# Altium schematic sheet Sheet_1_2026-01-07.schdoc
size 307 x 212 mm
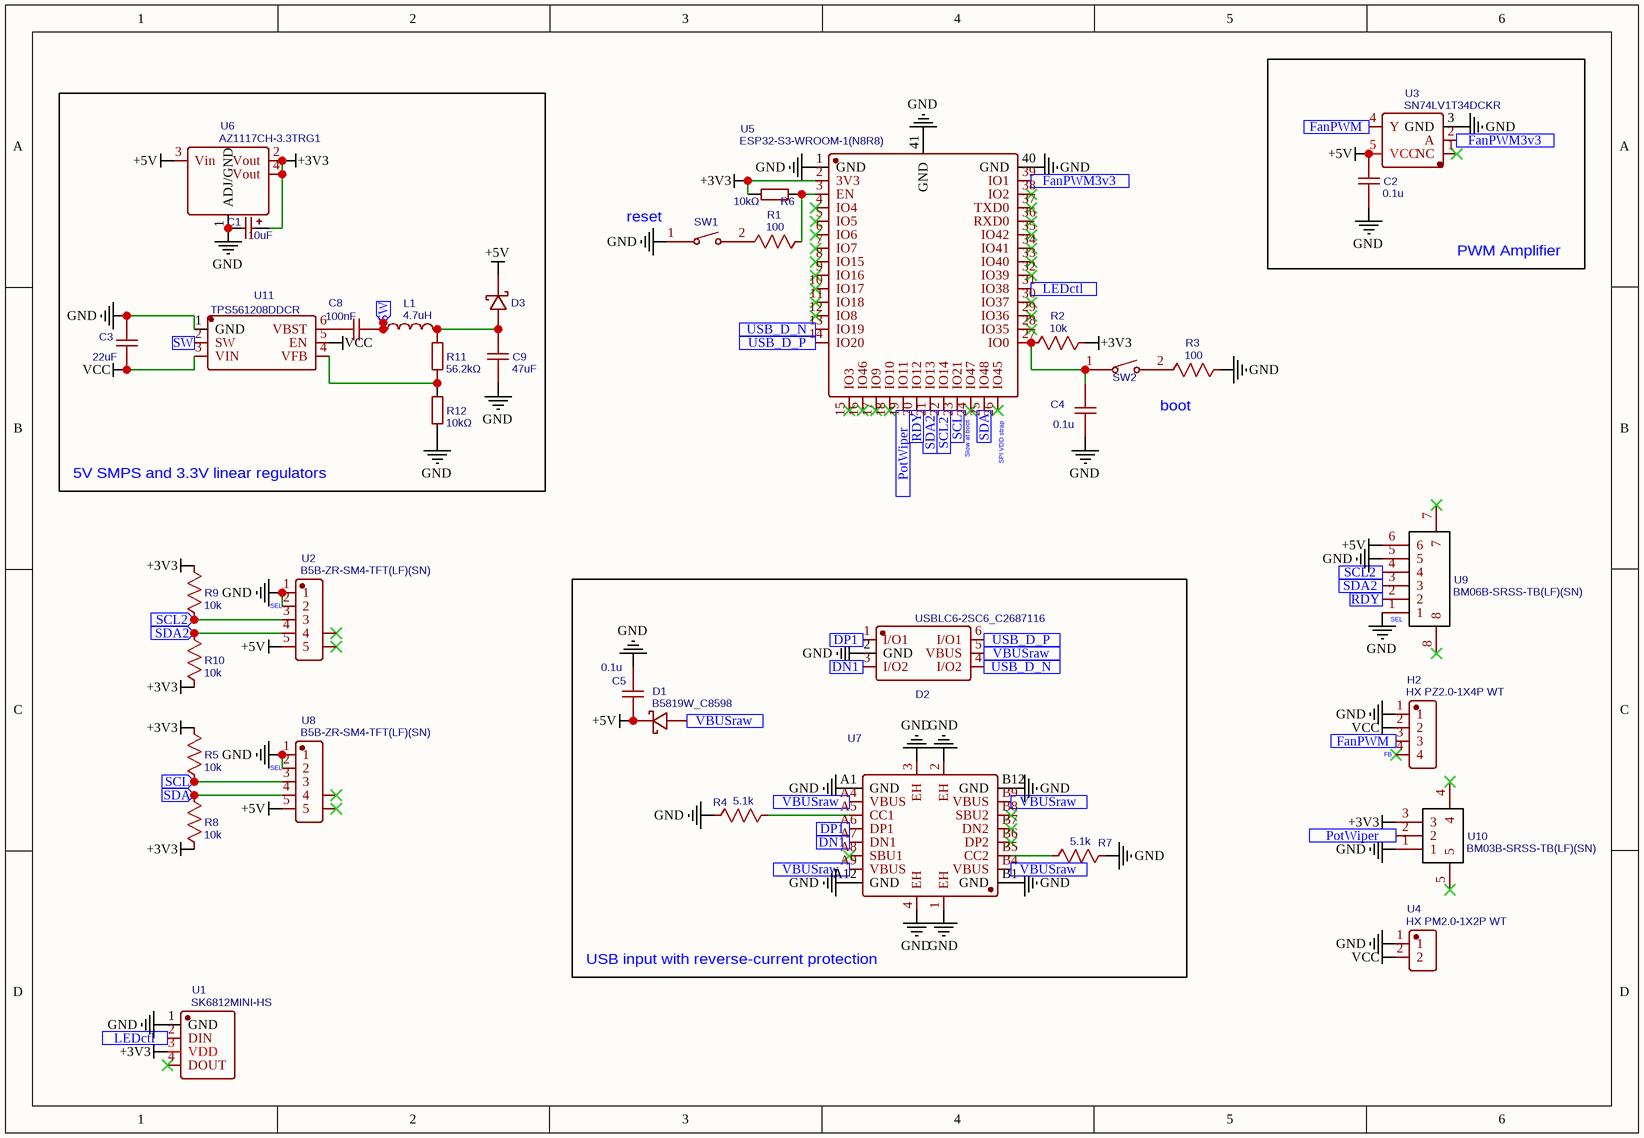
[diagram p0: Sheet_1_2026-01-07.schdoc]

## Parts
C1  10uF  [CAP-SMD_L3.2-W1.6-RD-C7171]
C2  0.1u  [C0603]
C3  22uF  [C0805]
C4  0.1u  [C0603]
C5  0.1u  [C0603]
C8  100nF  [C0402]
C9  47uF  [C1206]
D1  B5819W_C8598  [SOD-123_L2.7-W1.6-LS3.7-RD-1]
D2  USBLC6-2SC6_C2687116  [SOT-23-6_L2.9-W1.6-P0.95-LS2.8-BL]
D3  B5819W_C8598  [SOD-123_L2.7-W1.6-LS3.7-RD-1]  (value not drawn)
H2  HX PZ2.0-1X4P WT  [HDR-SMD_4P-P2.00-H-M-W6.0-N]
L1  4.7uH  [L1008]
R1  100  [R0603]
R2  10k  [R0603]
R3  100  [R0603]
R4  5.1k  [R0603]
R5  10k  [R0603]
R6  10kΩ  [R0402]
R7  5.1k  [R0603]
R8  10k  [R0603]
R9  10k  [R0603]
R10  10k  [R0603]
R11  56.2kΩ  [R0402]
R12  10kΩ  [R0402]
SW1  TS-1088-AR02016  [SW-SMD_L3.9-W3.0-P4.45]  (value not drawn)
SW2  TS-1088-AR02016  [SW-SMD_L3.9-W3.0-P4.45]  (value not drawn)
U1  SK6812MINI-HS  [LED-SMD_4P-L3.5-W3.5-BR_SK6812MINI-HS]
U2  B5B-ZR-SM4-TFT(LF)(SN)  [CONN-SMD_B5B-ZR-SM4-TFT]
U3  SN74LV1T34DCKR  [SC-70-5_L2.1-W1.3-P0.65-LS2.1-BR]
U4  HX PM2.0-1X2P WT  [HDR-SMD_HX-PM2.0-1X2P-WT]
U5  ESP32-S3-WROOM-1(N8R8)  [WIRELM-SMD_ESP32-S3-WROOM-1]
U6  AZ1117CH-3.3TRG1  [SOT-223-3_L6.5-W3.4-P2.30-LS7.0-BR]
U7  TYPE-C 16P LTH6.8  [USB-C-SMD_TYPE-C-16P-LTH6.8]  (value not drawn)
U8  B5B-ZR-SM4-TFT(LF)(SN)  [CONN-SMD_B5B-ZR-SM4-TFT]
U9  BM06B-SRSS-TB(LF)(SN)  [CONN-SMD-6P-P1.00_BM06B-SRSS-TB-LF-SN]
U10  BM03B-SRSS-TB(LF)(SN)  [CONN-SMD-3P-P1.00_BM03B-SRSS-TB-LF-SN]
U11  TPS561208DDCR  [TSOT-23-6_L2.9-W1.6-P0.95-LS2.8-BR]

## Blocks framed on the sheet
PWM Amplifier: C2 U3
5V SMPS and 3.3V linear regulators: C1 C3 C8 C9 D3 L1 R11 R12 U6 U11
USB input with reverse-current protection: C5 D1 D2 R4 R7 U7

## Ports
DN1 (in), DP1 (in), FanPWM3v3 (in), FanPWM (in), LEDctl (in), PotWiper (in), RDY (in), SCL2 (in), SCL (in), SDA2 (in), SDA (in), SW (in), USB_D_N (in), USB_D_P (in), VBUSraw (in)

## Nets
+3V3: C1.1 R2.2 R5.2 R6.2 R8.1 R9.2 R10.1 U1.3(VDD) U5.2(3V3) U6.2(Vout) U6.4(Vout) U10.3
+5V: C2.1 C5.1 D1.1(-) D3.1(-) U2.5 U3.5(VCC) U6.3(Vin) U8.5 U9.6
GND: C1.2 C2.2 C3.2 C4.1 C5.2 C9.1 D2.2(GND) H2.1 R3.2 R4.1 R7.1 R12.1 SW1.1 U1.1(GND) U2.1 U2.2 U3.3(GND) U4.1 U5.1(GND) U5.40(GND) U5.41(GND) U6.1(ADJ/GND) U7.1(EH) U7.2(EH) U7.3(EH) U7.4(EH) U7.A1(GND) U7.A12(GND) U7.B1(GND) U7.B12(GND) U8.1 U8.2 U9.1 U9.5 U10.1 U11.1(GND)
VCC: C3.1 H2.2 U4.2 U11.3(VIN) U11.5(EN)
DN1: D2.3(I/O2) U7.A7(DN1) ; port DN1
DP1: D2.1(I/O1) U7.A6(DP1) ; port DP1
FanPWM: H2.3 U3.4(Y) ; port FanPWM
FanPWM3v3: U3.2(A) U5.39(IO1) ; port FanPWM3v3
LEDctl: U1.2(DIN) U5.31(IO38) ; port LEDctl
PotWiper: U5.19(IO11) U10.2 ; port PotWiper
RDY: U5.20(IO12) U9.2 ; port RDY
SCL: R5.1 U5.23(IO21) U8.3 ; port SCL
SCL2: R9.1 U2.3 U5.22(IO14) U9.4 ; port SCL2
SDA: R8.2 U5.25(IO48) U8.4 ; port SDA
SDA2: R10.2 U2.4 U5.21(IO13) U9.3 ; port SDA2
SW: C8.1 L1.1 U11.2(SW) ; port SW
USB_D_N: D2.4(I/O2) U5.13(IO19) ; port USB_D_N
USB_D_P: D2.6(I/O1) U5.14(IO20) ; port USB_D_P
VBUSraw: D1.2(+) D2.5(VBUS) U7.A4(VBUS) U7.A9(VBUS) U7.B4(VBUS) U7.B9(VBUS) ; port VBUSraw
NetC4_2: C4.2 R2.1 SW2.1 U5.27(IO0)
NetC8_2: C8.2 U11.6(VBST)
NetC9_2: C9.2 D3.2(+) L1.2 R11.2
NetR1_1: R1.1 SW1.2
NetR1_2: R1.2 R6.1 U5.3(EN)
NetR3_1: R3.1 SW2.2
NetR4_2: R4.2 U7.A5(CC1)
NetR7_2: R7.2 U7.B5(CC2)
NetR11_1: R11.1 R12.2 U11.4(VFB)

Not connected (* = marked no-connect by the designer): H2 4*; U1 4(DOUT)*; U2 6* 7*; U3 1(NC)*; U5 4(IO4)* 5(IO5)* 6(IO6)* 7(IO7)* 8(IO15)* 9(IO16)* 10(IO17)* 11(IO18)* 12(IO8)* 15(IO3)* 16(IO46)* 17(IO9)* 18(IO10)* 24(IO47)* 26(IO45)* 28(IO35)* 29(IO36)* 30(IO37)* 32(IO39)* 33(IO40)* 34(IO41)* 35(IO42)* 36(RXD0)* 37(TXD0)* 38(IO2)*; U7 A8(SBU1)* B6(DP2)* B7(DN2)* B8(SBU2)*; U8 6* 7*; U9 7* 8*; U10 4* 5*

## Notes on the sheet
- (near SW1) reset
- boot
- (near U5) Slow at boot
- (near U5) SPI VDD strap
- (near U2) SEL
- (near U9) SEL
- (near H2) FB
- (near U8) SEL

## Library data of the parts
C1 = 10uF: Manufacturer: Kyocera AVX; Manufacturer Part: TAJA106K016RNJ; nameAlias: Value; Supplier: LCSC; Supplier Part: C7171; JLCPCB Part Class: Basic Part; spicePre: C; spiceSymbolName: TAJA106K016RNJ
C2 C4 C5 = 0.1u: nameAlias: Value(F); Contributor: LCEDA_Lib; spicePre: C; spiceSymbolName: C_0603_US
C3 = 22uF: Manufacturer: SAMSUNG(三星); Manufacturer Part: CL21A226MAQNNNE; nameAlias: Value; Supplier: LCSC; Supplier Part: C45783; JLCPCB Part Class: Basic Part; spicePre: C; spiceSymbolName: CL21A226MAQNNNE
C8 = 100nF: Manufacturer Part: CL05B104KO5NNNC; Manufacturer: SAMSUNG(三星); nameAlias: Value; Supplier: LCSC; Supplier Part: C1525; JLCPCB Part Class: Basic Part; spicePre: C; spiceSymbolName: CL05B104KO5NNNC
C9 = 47uF: Manufacturer: SAMSUNG(三星); Manufacturer Part: CL31A476MPHNNNE; nameAlias: Value; Supplier: LCSC; Supplier Part: C96123; JLCPCB Part Class: Basic Part; spicePre: C; spiceSymbolName: CL31A476MPHNNNE
D1 D3 = B5819W_C8598: Manufacturer: CJ(江苏长电/长晶); Manufacturer Part: B5819W SL; Supplier: LCSC; Supplier Part: C8598; JLCPCB Part Class: Basic Part; spicePre: D; spiceSymbolName: B5819W_C8598
D2 = USBLC6-2SC6_C2687116: Manufacturer: UMW(友台半导体); Contributor: LCSC; Supplier: LCSC; Supplier Part: C2687116; Manufacturer Part: USBLC6-2SC6; JLCPCB Part Class: Extended Part; spicePre: D; spiceSymbolName: USBLC6-2SC6_C2687116
H2 = HX PZ2.0-1X4P WT: Manufacturer: hanxia(韩下); Contributor: lcsc; Supplier: LCSC; Supplier Part: C42455215; Manufacturer Part: HX PZ2.0-1x4P WT; JLCPCB Part Class: Extended Part; spicePre: H; spiceSymbolName: HX PZ2.0-1X4P WT
L1 = 4.7uH: Manufacturer: muRata(村田); Manufacturer Part: LQM2HPN4R7MG0L; nameAlias: Value; Supplier: LCSC; Supplier Part: C82314; JLCPCB Part Class: Extended Part; spicePre: L; spiceSymbolName: LQM2HPN4R7MG0L
R1 R3 = 100: nameAlias: Value(Ω); Contributor: LCEDA_Lib; spicePre: R; spiceSymbolName: R_0603_US
R2 R5 R8-R10 = 10k: nameAlias: Value(Ω); Contributor: LCEDA_Lib; spicePre: R; spiceSymbolName: R_0603_US
R4 R7 = 5.1k: nameAlias: Value(Ω); Contributor: LCEDA_Lib; spicePre: R; spiceSymbolName: R_0603_US
R6 R12 = 10kΩ: Manufacturer: UNI-ROYAL(厚声); Manufacturer Part: 0402WGF1002TCE; nameAlias: Value; Supplier: LCSC; Supplier Part: C25744; JLCPCB Part Class: Basic Part; spicePre: R; spiceSymbolName: 0402WGF1002TCE
R11 = 56.2kΩ: Manufacturer: YAGEO(国巨); Manufacturer Part: RC0402FR-0756K2L; nameAlias: Value; Contributor: LCSC; Supplier: LCSC; Supplier Part: C183355; JLCPCB Part Class: Extended Part; spicePre: R; spiceSymbolName: RC0402FR-0756K2L
SW1 SW2 = TS-1088-AR02016: Manufacturer: XUNPU(讯普); Contributor: LCSC; Supplier: LCSC; Supplier Part: C720477; Manufacturer Part: TS-1088-AR02016; JLCPCB Part Class: Basic Part; spicePre: S; spiceSymbolName: TS-1088-AR02016
U1 = SK6812MINI-HS: Manufacturer: 欧思科光电; Contributor: LCSC; Supplier: LCSC; Supplier Part: C2922787; Manufacturer Part: SK6812MINI-HS; JLCPCB Part Class: Extended Part; spicePre: U; spiceSymbolName: SK6812MINI-HS
U2 U8 = B5B-ZR-SM4-TFT(LF)(SN): Manufacturer: JST; Contributor: LCSC; Supplier: LCSC; Supplier Part: C471524; Manufacturer Part: B5B-ZR-SM4-TFT(LF)(SN); JLCPCB Part Class: Extended Part; spicePre: U; spiceSymbolName: B5B-ZR-SM4-TFT(LF)(SN)
U3 = SN74LV1T34DCKR: Manufacturer: TI(德州仪器); Contributor: LCSC; Supplier: LCSC; Supplier Part: C78541; Manufacturer Part: SN74LV1T34DCKR; JLCPCB Part Class: Extended Part; spicePre: U; spiceSymbolName: SN74LV1T34DCKR
U4 = HX PM2.0-1X2P WT: Manufacturer: hanxia(韩下); Contributor: lcsc; Supplier: LCSC; Supplier Part: C46061752; Manufacturer Part: HX PM2.0-1x2P WT; JLCPCB Part Class: Extended Part; spicePre: U; spiceSymbolName: HX PM2.0-1X2P WT
U5 = ESP32-S3-WROOM-1(N8R8): Manufacturer: ESPRESSIF(乐鑫); Manufacturer Part: ESP32-S3-WROOM-1-N8R8; Contributor: LCSC; Supplier: LCSC; Supplier Part: C2913201; JLCPCB Part Class: Extended Part; spicePre: U; spiceSymbolName: ESP32-S3-WROOM-1(N8R8)
U6 = AZ1117CH-3.3TRG1: Manufacturer: DIODES(美台); Supplier: LCSC; Manufacturer Part: AZ1117CH-3.3TRG1; Supplier Part: C92102; JLCPCB Part Class: Extended Part; spicePre: U; spiceSymbolName: AZ1117CH-3.3TRG1
U7 = TYPE-C 16P LTH6.8: Manufacturer: SHOU HAN(首韩); Contributor: lcsc; Supplier: LCSC; Supplier Part: C5187468; Manufacturer Part: TYPE-C 16P LTH6.8; JLCPCB Part Class: Extended Part; spicePre: U; spiceSymbolName: TYPE-C 16P LTH6.8
U9 = BM06B-SRSS-TB(LF)(SN): Manufacturer: JST; Contributor: LCSC; Supplier: LCSC; Supplier Part: C160392; Manufacturer Part: BM06B-SRSS-TB(LF)(SN); JLCPCB Part Class: Extended Part; spicePre: U; spiceSymbolName: BM06B-SRSS-TB(LF)(SN)
U10 = BM03B-SRSS-TB(LF)(SN): Manufacturer: JST; Contributor: LCSC; Supplier: LCSC; Supplier Part: C160389; Manufacturer Part: BM03B-SRSS-TB(LF)(SN); JLCPCB Part Class: Extended Part; spicePre: U; spiceSymbolName: BM03B-SRSS-TB(LF)(SN)
U11 = TPS561208DDCR: Manufacturer: TI(德州仪器); Contributor: LCSC; Supplier: LCSC; Supplier Part: C138335; Manufacturer Part: TPS561208DDCR; JLCPCB Part Class: Extended Part; spicePre: U; spiceSymbolName: TPS561208DDCR